# Altium project LM-003.PrjPcb (part 2 of 4)

## Sheet FeedbackLoop.SchDoc: Sync Demod
size Tabloid; DocumentNumber: LM-003; Revision: 3.0; SheetNumber: 2; SheetTotal: 11
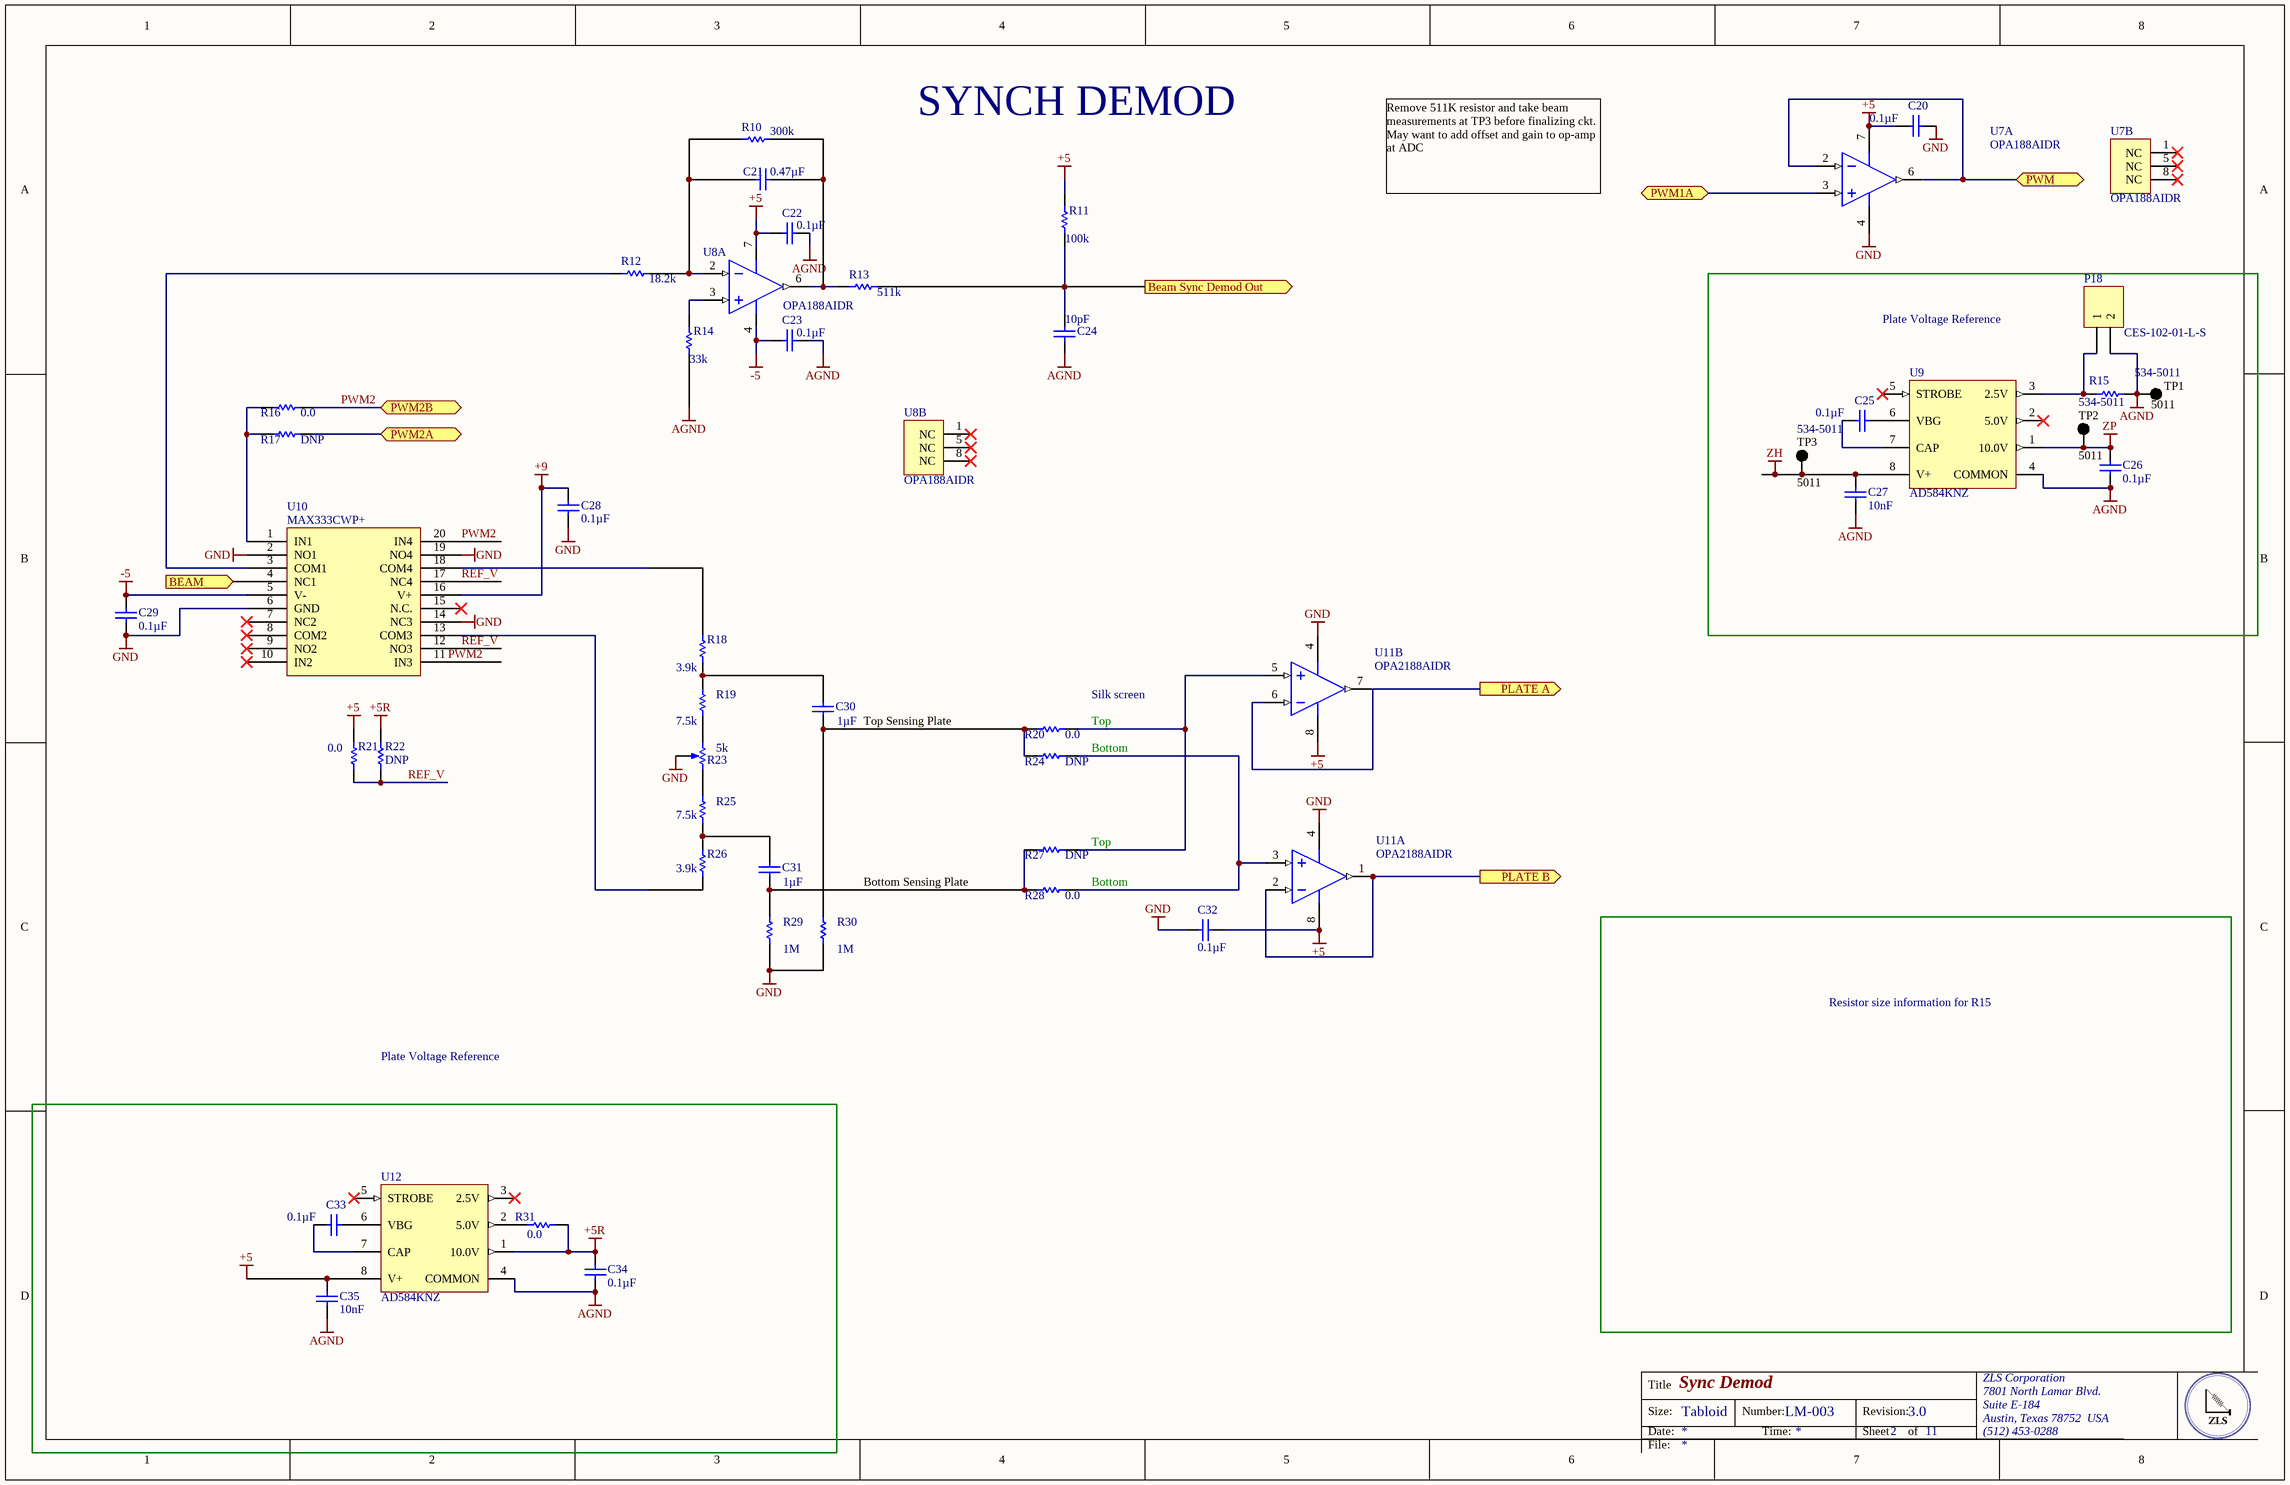
[diagram p1: FeedbackLoop.SchDoc]

### Parts
(Parts that share a designator on the sheet are numbered #1, #2 ... from top to bottom, then left to right.)
C20  Capacitance: 0.1µF  [CAPC0805(2012)100_N]  (hidden comment: CAP 100nF 25V 0805(2012))
C21  Capacitance: 0.47µF  [CAPC0805(2012)145_N]  (hidden comment: CAP CER 0.47UF 25V X7R 0805)
C22  Capacitance: 0.1µF  [CAPC0805(2012)145_N]  (hidden comment: CAP CER 0.1UF 16V X7R 0805)
C23  Capacitance: 0.1µF  [CAPC0805(2012)145_N]  (hidden comment: CAP CER 0.1UF 25V X7R 0805)
C24  Capacitance: 10pF  [CAPC0805(2012)145_N]  (hidden comment: CAP CER 10PF 200V C0G/NP0 0805)
C25  Capacitance: 0.1µF  [CAPC0805(2012)100_N]  (hidden comment: CAP 100nF 25V 0805(2012))
C26  Capacitance: 0.1µF  [CAPC0805(2012)145_N]  (hidden comment: CAP CER 0.1UF 25V X7R 0805)
C27  Capacitance: 10nF  [CAPC0805(2012)145_N]  (hidden comment: Multilayer Ceramic Capacitors MLCC - SMD/SMT 0.01uF 50volts 10% X7R)
C28  Capacitance: 0.1µF  [CAPC0805(2012)145_N]  (hidden comment: CAP CER 0.1UF 25V X7R 0805)
C29  Capacitance: 0.1µF  [CAPC0805(2012)145_N]  (hidden comment: CAP CER 0.1UF 25V X7R 0805)
C30  Capacitance: 1µF  [CAPC0805(2012)155_L]  (hidden comment: CAP CER 1UF 25V X7R 0805)
C31  Capacitance: 1µF  [CAPC0805(2012)155_L]  (hidden comment: CAP CER 1UF 25V X7R 0805)
C32  Capacitance: 0.1µF  [CAPC0805(2012)155_L]  (hidden comment: CAP CER 0.1UF 25V X7R 0805)
C33  Capacitance: 0.1µF  [CAPC0805(2012)100_N]  (hidden comment: CAP 100nF 25V 0805(2012))
C34  Capacitance: 0.1µF  [CAPC0805(2012)145_N]  (hidden comment: CAP CER 0.1UF 25V X7R 0805)
C35  Capacitance: 10nF  [CAPC0805(2012)145_N]  (hidden comment: Multilayer Ceramic Capacitors MLCC - SMD/SMT 0.01uF 50volts 10% X7R)
P18  LOW PROFILE .025" SQUARE STRIPS  [CES-102-01-L-S]  (value not drawn)
R10  Resistance (Ohms): 300k  [RESC0805(2012)_M]  (hidden comment: RES SMD 300K OHM 1% 1/8W 0805)
R11  Resistance (Ohms): 100k  [RESC0805(2012)_M]  (hidden comment: RES SMD 100K OHM 1% 1/2W 0805)
R12  Resistance (Ohms): 18.2k  [RESC0805(2012)_M]  (hidden comment: RES SMD 18.2K OHM 1% 1/8W 0805)
R13  Resistance (Ohms): 511k  [RESC0805(2012)_M]  (hidden comment: RES SMD 511K OHM 1% 1/8W 0805)
R14  Resistance (Ohms): 33k  [RESC0805(2012)_M]  (hidden comment: RES SMD 33K OHM 1% 1/2W 0805)
R15  TBD  [VH102K]  (value not drawn)
R16  Resistance (Ohms): 0.0  [RESC0805(2012)_M]  (hidden comment: RES SMD 0.0 OHM JUMPER 1/8W 0805)
R17  Resistance (Ohms): DNP  [RESC0805(2012)_M]  (hidden comment: RES SMD 0.0 OHM JUMPER 1/8W 0805)
R18  Resistance (Ohms): 3.9k  [RESC0805(2012)_N]  (hidden comment: RES SMD 3.9K OHM 5% 1/8W 0805)
R19  Resistance (Ohms): 7.5k  [RESC0805(2012)_N]  (hidden comment: RES SMD 7.5K OHM 1% 1/8W 0805)
R20  Resistance (Ohms): 0.0  [RESC0805(2012)_M]  (hidden comment: RES SMD 0.0 OHM JUMPER 1/8W 0805)
R21  Resistance (Ohms): 0.0  [RESC0805(2012)_M]  (hidden comment: RES SMD 0.0 OHM JUMPER 1/8W 0805)
R22  DNP  [RESC0805(2012)_M]
R23  Resistance (Ohms): 5k  [Trimmer 2.54]  (hidden comment: TRIMMER 5K OHM 0.25W PC PIN)
R24  Resistance (Ohms): DNP  [RESC0805(2012)_M]  (hidden comment: RES SMD 0.0 OHM JUMPER 1/8W 0805)
R25  Resistance (Ohms): 7.5k  [RESC0805(2012)_N]  (hidden comment: RES SMD 7.5K OHM 1% 1/8W 0805)
R26  Resistance (Ohms): 3.9k  [RESC0805(2012)_N]  (hidden comment: RES SMD 3.9K OHM 5% 1/8W 0805)
R27  Resistance (Ohms): DNP  [RESC0805(2012)_M]  (hidden comment: RES SMD 0.0 OHM JUMPER 1/8W 0805)
R28  Resistance (Ohms): 0.0  [RESC0805(2012)_M]  (hidden comment: RES SMD 0.0 OHM JUMPER 1/8W 0805)
R29  Resistance (Ohms): 1M  [RESC0805(2012)_N]  (hidden comment: RES SMD 1M OHM 1% 1/8W 0805)
R30  Resistance (Ohms): 1M  [RESC0805(2012)_N]  (hidden comment: RES SMD 1M OHM 1% 1/8W 0805)
R31  Resistance (Ohms): 0.0  [RESC0805(2012)_M]  (hidden comment: RES SMD 0.0 OHM JUMPER 1/8W 0805)
TP1  5011  Supplier Part Number 1: 534-5011  [KSTN-5011_V]
TP2  5011  Supplier Part Number 1: 534-5011  [KSTN-5011_V]
TP3  5011  Supplier Part Number 1: 534-5011  [KSTN-5011_V]
U7#1  OPA188AIDR  [D0008A_M]  (part B of 2)
U7#2  OPA188AIDR  [D0008A_M]  (part A of 2)
U8#1  OPA188AIDR  [D0008A_M]  (part A of 2)
U8#2  OPA188AIDR  [D0008A_M]  (part B of 2)
U9  AD584KNZ  [ADI-N-8]
U10  MAX333CWP+  [TSOP65P640X90-20N]
U11  OPA2188AIDR  [D0008A_L]  (parts A,B of 2)
U12  AD584KNZ  [ADI-N-8]

### Blocks framed on the sheet
Plate Voltage Reference: C25-C27 P18 R15 TP1-TP3 U9

### Ports
BEAM (in), Beam Sync Demod Out (out), PLATE A (out), PLATE B (out), PWM, PWM1A, PWM2A, PWM2B

### Nets
+5: C20.1 C22.1 C32.1 C35.1 R11.2 R21.2 U7#2.7(V+) U8#1.7(V+) U11.8(V+) U12.8(V+)
+5R: C34.1 R22.2 R31.1 U12.1(10.0V)
+9: C28.2 U10.16(V+)
-5: C23.2 C29.1 U8#1.4(V-) U10.5(V-)
AGND: C22.2 C23.1 C24.2 C26.2 C27.2 C34.2 C35.2 P18.2 R14.1 R15.2 TP1.1 U9.4(COMMON) U12.4(COMMON)
GND: C20.2 C28.1 C29.2 C32.2 R23.2(b) R29.1 R30.1 U7#2.4(V-) U10.2(NO1) U10.6(GND) U10.14(NC3) U10.19(NO4) U11.4(V-)
ZH: C27.1 TP3.1 U9.8(V+)
ZP: C26.1 TP2.1 U9.1(10.0V)
BEAM: U10.4(NC1) ; port BEAM
PWM2: R16.1 U10.20(IN4) ; port PWM2B
REF_V: R21.1 R22.1 U10.12(NO3) U10.17(NC4)
NetC21_1: C21.1 R10.2 R12.2 U8#1.2(IN-)
NetC21_2: C21.2 R10.1 R13.2 U8#1.6(OUT)
NetC24_1: C24.1 R11.1 R13.1 ; port Beam Sync Demod Out
NetC25_1: C25.1 U9.7(CAP)
NetC25_2: C25.2 U9.6(VBG)
NetC30_1: C30.1 R20.2 R24.2 R30.2
NetC30_2: C30.2 R18.1 R19.2
NetC31_1: C31.1 R27.2 R28.2 R29.2
NetC31_2: C31.2 R25.1 R26.2
NetC33_1: C33.1 U12.7(CAP)
NetC33_2: C33.2 U12.6(VBG)
NetP3_2: U11.1(OUT_A) U11.2(IN_A-) ; port PLATE B
NetP3_4: U11.6(IN_B-) ; port PLATE A
NetP3_12: U7#2.2(IN-) U7#2.6(OUT) ; port PWM
NetP18_1: P18.1 R15.1 U9.3(2.5V)
NetR12_1: R12.1 U10.3(COM1)
NetR14_2: R14.2 U8#1.3(IN+)
NetR16_2: R16.2 R17.2 U10.1(IN1)
NetR17_1: R17.1 ; port PWM2A
NetR18_2: R18.2 U10.18(COM4)
NetR19_1: R19.1 R23.3(c)
NetR20_1: R20.1 R27.1 U11.5(IN_B+)
NetR23_1: R23.1(a) R25.2
NetR24_1: R24.1 R28.1 U11.3(IN_A+)
NetR26_1: R26.1 U10.13(COM3)
NetR31_2: R31.2 U12.2(5.0V)
NetU7#2_3: U7#2.3(IN+) ; port PWM1A

Not connected (* = marked no-connect by the designer): U7#1 1(NC)* 5(NC)* 8(NC)*; U8#2 1(NC)* 5(NC)* 8(NC)*; U9 2(5.0V)* 5(STROBE)*; U10 7(NC2)* 8(COM2)* 9(NO2)* 10(IN2)* 11(IN3) 15(N.C.)*; U11 7(OUT_B); U12 3(2.5V)* 5(STROBE)*

### Notes on the sheet
- SYNCH DEMOD
- Remove 511K resistor and take beam measurements at TP3 before finalizing ckt.
  May want to add offset and gain to op-amp at ADC
- Silk screen
- (near C30) Top Sensing Plate
- Top
- Bottom
- Bottom Sensing Plate
- (near R27) Top
- Resistor size information for R15
- Plate Voltage Reference
- Labels drawn without touching a wire or pin: PWM2
- Title
- Size:
- Date:
- Tabloid
- Number:
- Time:
- Revision:
- Sheet
- of
- ZLS Corporation
- 7801 North Lamar Blvd.
- Suite E-184
- Austin, Texas 78752  USA
- (512) 453-0288
- File:

### Library data of the parts
C20 C25 C33 = CMP-1036-04416-1: CAP 100nF 25V -20% to +80% 0805 (2012 Metric) Thickness 1mm SMD; Manufacturer: Murata Electronics North America; Manufacturer Part Number: GRM21BR71E104KA01L; Tolerance: ±10%; Temperature Coefficient: X7R; Supplier 1: Digi-Key; Supplier Part Number 1: 490-1673-1-ND; RoHS: RoHS Compliant; Category: Capacitors; Stock 1: 895391; Pricing 1: 1=0.2, 10=0.145, 100=0.0683, 500=0.04788, 1000=0.03964 (USD); Packaging: Cut Tape (CT); Part Status: Active; Voltage - Rated: 25V; Operating Temperature: -55°C ~ 125°C; Features: -; Ratings: -; Applications: General Purpose; Mounting Type: Surface Mount, MLCC; Package / Case: 0805 (2012 Metric); Size / Dimension: 0.079" L x 0.049" W (2.00mm x 1.25mm); Height - Seated (Max): -; Thickness (Max): 0.053" (1.35mm); Lead Spacing: -; Lead Style: -; ComponentLink1URL: http://www.murata.com/~/media/webrenewal/support/library/catalog/products/capacitor/mlcc/c02e.ashx; ComponentLink1Description: http://www.murata.com/~/media/webrenewal/support/library/catalog/products/capacitor/mlcc/c02e.ashx
C21 = CMP-1036-04795-1: Manufacturer: Murata Electronics North America; Manufacturer Part Number: GRM219R71E474KA88D; Tolerance: ±10%; Supplier 1: Digi-Key; Supplier Part Number 1: 490-11584-6-ND; RoHS: RoHS Compliant; Category: Capacitors; Stock 1: 575; Pricing 1: 1=0.33, 10=0.229, 100=0.1377, 500=0.10324, 1000=0.08718 (USD); Packaging: Digi-Reel®; Part Status: Active; Voltage - Rated: 25V; Temperature Coefficient: X7R; Operating Temperature: -55°C ~ 125°C; Features: -; Ratings: -; Applications: General Purpose; Mounting Type: Surface Mount, MLCC; Package / Case: 0805 (2012 Metric); Size / Dimension: 0.079" L x 0.049" W (2.00mm x 1.25mm); Height - Seated (Max): -; Thickness (Max): 0.037" (0.95mm); Lead Spacing: -; Lead Style: -; ComponentLink1URL: http://www.murata.com/~/media/webrenewal/support/library/catalog/products/capacitor/mlcc/c02e.ashx; ComponentLink1Description: http://www.murata.com/~/media/webrenewal/support/library/catalog/products/capacitor/mlcc/c02e.ashx
C22 = CMP-1036-04795-1: Manufacturer: Murata Electronics North America; Manufacturer Part Number: GRM219R71C104KA01D; Tolerance: ±10%; Voltage - Rated: 25V; Supplier Part Number 1: 490-1673-6-ND; Temperature Coefficient: X7R; Thickness (Max): 0.053" (1.35mm); Supplier 2: Digi-Key; Supplier Part Number 2: 490-1683-6-ND; RoHS: RoHS Compliant; Category: Capacitors; Stock 2: 245331; Pricing 2: 1=0.14, 10=0.098, 100=0.0462, 500=0.0324, 1000=0.02683 (USD); Packaging: Digi-Reel®; Part Status: Active; Operating Temperature: -55°C ~ 125°C; Features: -; Ratings: -; Applications: General Purpose; Mounting Type: Surface Mount, MLCC; Package / Case: 0805 (2012 Metric); Size / Dimension: 0.079" L x 0.049" W (2.00mm x 1.25mm); Height - Seated (Max): -; Lead Spacing: -; Lead Style: -; ComponentLink1URL: http://www.murata.com/~/media/webrenewal/support/library/catalog/products/capacitor/mlcc/c02e.ashx; ComponentLink1Description: http://www.murata.com/~/media/webrenewal/support/library/catalog/products/capacitor/mlcc/c02e.ashx
C23 C26 C28 C29 C34 = CMP-1036-04795-1: Manufacturer: Murata Electronics North America; Manufacturer Part Number: GRM21BR71E104KA01L; Tolerance: ±10%; Supplier 1: Digi-Key; Supplier Part Number 1: 490-1673-6-ND; RoHS: RoHS Compliant; Category: Capacitors; Stock 1: 891652; Pricing 1: 1=0.2, 10=0.145, 100=0.0683, 500=0.04788, 1000=0.03964 (USD); Packaging: Digi-Reel®; Part Status: Active; Voltage - Rated: 25V; Temperature Coefficient: X7R; Operating Temperature: -55°C ~ 125°C; Features: -; Ratings: -; Applications: General Purpose; Mounting Type: Surface Mount, MLCC; Package / Case: 0805 (2012 Metric); Size / Dimension: 0.079" L x 0.049" W (2.00mm x 1.25mm); Height - Seated (Max): -; Thickness (Max): 0.053" (1.35mm); Lead Spacing: -; Lead Style: -; ComponentLink1URL: http://www.murata.com/~/media/webrenewal/support/library/catalog/products/capacitor/mlcc/c02e.ashx; ComponentLink1Description: http://www.murata.com/~/media/webrenewal/support/library/catalog/products/capacitor/mlcc/c02e.ashx
C24 = CMP-1036-04795-1: Manufacturer: Murata Electronics North America; Manufacturer Part Number: GRM21A5C2D100JW01D; Tolerance: ±5%; Temperature Coefficient: C0G, NP0; Supplier 1: Digi-Key; Supplier Part Number 1: 490-14649-1-ND; RoHS: RoHS Compliant; Category: Capacitors; Stock 1: 957; Pricing 1: 1=0.3, 10=0.205, 100=0.1038, 500=0.07104, 1000=0.06285 (USD); Packaging: Cut Tape (CT); Part Status: Active; Voltage - Rated: 200V; Operating Temperature: -55°C ~ 125°C; Features: -; Ratings: -; Applications: General Purpose; Failure Rate: -; Mounting Type: Surface Mount, MLCC; Package / Case: 0805 (2012 Metric); Size / Dimension: 0.079" L x 0.049" W (2.00mm x 1.25mm); Height - Seated (Max): -; Thickness (Max): 0.039" (1.00mm); Lead Spacing: -; Lead Style: -; ComponentLink1URL: http://search.murata.co.jp/Ceramy/image/img/A01X/G101/ENG/GRM21A5C2D100JW01-01.pdf; ComponentLink1Description: http://search.murata.co.jp/Ceramy/image/img/A01X/G101/ENG/GRM21A5C2D100JW01-01.pdf
C27 C35 = CMP-1036-04795-1: Manufacturer: Kemet; Manufacturer Part Number: C0805C103K5RACAUTO; Voltage Rating: 50V; Supplier 1: Digi-Key; Supplier Part Number 1: 399-6924-1-ND; Stock 1: 63236; Pricing 1: 1=0.12, 10=0.087, 100=0.041, 500=0.0287, 1000=0.0238 (USD); Mount: Surface Mount; Case/Package: 0805; Case Code (Metric): 2012; Case Code (Imperial): 0805; Dielectric Material: Ceramic; Contact Plating: Tin; Min Operating Temperature: -55°C; Max Operating Temperature: 125°C; Tolerance: 10%; Packaging: Tape and Reel; Package Quantity: 1; Voltage Rating (DC): 50V; Dielectric: X7R; Termination: SMD/SMT; Length: 2mm; Height: 0.78mm; Width: 0.049inch; Thickness: 0.035inch; Depth: 1.25mm; Radiation Hardening: No; REACH SVHC: No SVHC; ComponentLink1URL: https://datasheet.ciiva.com/22700/1693454-22700519.pdf; ComponentLink1Description: https://datasheet.ciiva.com/22700/1693454-22700519.pdf; ComponentLink2URL: https://datasheet.ciiva.com/7842/1693454-7842175.pdf; ComponentLink2Description: https://datasheet.ciiva.com/7842/1693454-7842175.pdf
C30 C31 = CMP-1036-04882-1: Manufacturer: Murata Electronics North America; Manufacturer Part Number: GRM21BR71E105KA99L; Tolerance: ±10%; Supplier 1: Digi-Key; Supplier Part Number 1: 490-6484-6-ND; RoHS: RoHS Compliant; Category: Capacitors; Stock 1: 295074; Pricing 1: 1=0.14, 10=0.099, 100=0.0468, 500=0.0328, 1000=0.02715 (USD); Packaging: Digi-Reel®; Part Status: Active; Voltage - Rated: 25V; Temperature Coefficient: X7R; Operating Temperature: -55°C ~ 125°C; Features: -; Ratings: -; Applications: General Purpose; Mounting Type: Surface Mount, MLCC; Package / Case: 0805 (2012 Metric); Size / Dimension: 0.079" L x 0.049" W (2.00mm x 1.25mm); Height - Seated (Max): -; Thickness (Max): 0.053" (1.35mm); Lead Spacing: -; Lead Style: -; ComponentLink1URL: http://www.murata.com/~/media/webrenewal/support/library/catalog/products/capacitor/mlcc/c02e.ashx; ComponentLink1Description: http://www.murata.com/~/media/webrenewal/support/library/catalog/products/capacitor/mlcc/c02e.ashx
C32 = CMP-1036-04882-1: Manufacturer: Murata Electronics North America; Manufacturer Part Number: GRM21BR71E104KA01L; Tolerance: ±10%; Supplier 1: Digi-Key; Supplier Part Number 1: 490-1673-6-ND; RoHS: RoHS Compliant; Category: Capacitors; Stock 1: 891652; Pricing 1: 1=0.2, 10=0.145, 100=0.0683, 500=0.04788, 1000=0.03964 (USD); Packaging: Digi-Reel®; Part Status: Active; Voltage - Rated: 25V; Temperature Coefficient: X7R; Operating Temperature: -55°C ~ 125°C; Features: -; Ratings: -; Applications: General Purpose; Mounting Type: Surface Mount, MLCC; Package / Case: 0805 (2012 Metric); Size / Dimension: 0.079" L x 0.049" W (2.00mm x 1.25mm); Height - Seated (Max): -; Thickness (Max): 0.053" (1.35mm); Lead Spacing: -; Lead Style: -; ComponentLink1URL: http://www.murata.com/~/media/webrenewal/support/library/catalog/products/capacitor/mlcc/c02e.ashx; ComponentLink1Description: http://www.murata.com/~/media/webrenewal/support/library/catalog/products/capacitor/mlcc/c02e.ashx
P18 = Header 2: Manufacturer: Samtec Inc.; Connector Type: Receptacle; Style: Board to Board; Number of Positions: 2; Number of Positions Loaded: All; Pitch - Mating: 0.100" (2.54mm); Contact Length - Post: 0.128" (3.25mm); Material Flammability Rating: UL94 V-0; Supplier 1: Digi-Key; Supplier Part Number 1: CES-102-01-L-S-ND; Manufacturer Part Number: CES-102-01-L-S; RoHS: RoHS Compliant; Category: Connectors, Interconnects; Stock 1: 0; Pricing 1: 1=0.61 (USD); Packaging: Bulk; Part Status: Active; Contact Type: Female Socket; Number of Rows: 1; Row Spacing - Mating: -; Mounting Type: Through Hole; Termination: Solder; Fastening Type: Push-Pull; Contact Finish - Mating: Gold; Contact Finish Thickness - Mating: 10µin (0.25µm); Insulation Color: Black; Insulation Height: 0.200" (5.08mm); Operating Temperature: -55°C ~ 125°C; Contact Finish - Post: Tin; Mated Stacking Heights: -; Ingress Protection: -; Features: -; Current Rating: -; Voltage Rating: -; Applications: -; Insulation Material: Polybutylene Terephthalate (PBT); Contact Shape: Square; Contact Material: Phosphor Bronze; Contact Finish Thickness - Post: -; ComponentLink1URL: http://suddendocs.samtec.com/prints/ces-1xx-xx-x-s-xx-mkt.pdf; ComponentLink1Description: http://suddendocs.samtec.com/prints/ces-1xx-xx-x-s-xx-mkt.pdf
R10 = CMP-1013-00017-1: Manufacturer: Vishay Dale; Manufacturer Part Number: CRCW0805300KFKEA; Power (Watts): 0.125W, 1/8W; Temperature Coefficient: ±100ppm/°C; Supplier 1: Digi-Key; Supplier Part Number 1: 541-300KCDKR-ND; RoHS: RoHS Compliant; Category: Resistors; Stock 1: 22918; Pricing 1: 1=0.1, 10=0.044, 100=0.0178, 1000=0.00802, 2500=0.00696 (USD); Packaging: Digi-Reel®; Part Status: Active; Tolerance: ±1%; Composition: Thick Film; Features: Automotive AEC-Q200; Operating Temperature: -55°C ~ 155°C; Package / Case: 0805 (2012 Metric); Supplier Device Package: 0805; Size / Dimension: 0.079" L x 0.049" W (2.00mm x 1.25mm); Height - Seated (Max): 0.020" (0.50mm); Failure Rate: -; ComponentLink1URL: http://www.vishay.com/docs/20035/dcrcwe3.pdf; ComponentLink1Description: http://www.vishay.com/docs/20035/dcrcwe3.pdf
R11 = CMP-1013-00017-1: Manufacturer: Vishay Dale; Manufacturer Part Number: CRCW0805100KFKEAHP; Power (Watts): 0.5W, 1/2W; Temperature Coefficient: ±100ppm/°C; Supplier 1: Digi-Key; Supplier Part Number 1: 541-100KTDKR-ND; RoHS: RoHS Compliant; Category: Resistors; Stock 1: 1548; Pricing 1: 1=0.28, 10=0.233, 100=0.0911, 1000=0.03812, 2500=0.03494 (USD); Packaging: Digi-Reel®; Part Status: Active; Tolerance: ±1%; Composition: Thick Film; Features: Automotive AEC-Q200, Pulse Withstanding; Operating Temperature: -55°C ~ 155°C; Package / Case: 0805 (2012 Metric); Supplier Device Package: 0805; Size / Dimension: 0.079" L x 0.049" W (2.00mm x 1.25mm); Height - Seated (Max): 0.020" (0.50mm); Failure Rate: -; ComponentLink1URL: http://www.vishay.com/docs/20043/crcwhpe3.pdf; ComponentLink1Description: http://www.vishay.com/docs/20043/crcwhpe3.pdf
R12 = CMP-1013-00017-1: Manufacturer: Vishay Dale; Manufacturer Part Number: CRCW080518K2FKEA; Power (Watts): 0.125W, 1/8W; Temperature Coefficient: ±100ppm/°C; Supplier 1: Digi-Key; Supplier Part Number 1: 541-18.2KCDKR-ND; RoHS: RoHS Compliant; Category: Resistors; Stock 1: 12440; Pricing 1: 1=0.1, 10=0.044, 100=0.0178, 1000=0.00802, 2500=0.00696 (USD); Packaging: Digi-Reel®; Part Status: Active; Tolerance: ±1%; Composition: Thick Film; Features: Automotive AEC-Q200; Operating Temperature: -55°C ~ 155°C; Package / Case: 0805 (2012 Metric); Supplier Device Package: 0805; Size / Dimension: 0.079" L x 0.049" W (2.00mm x 1.25mm); Height - Seated (Max): 0.020" (0.50mm); Failure Rate: -; ComponentLink1URL: http://www.vishay.com/docs/20035/dcrcwe3.pdf; ComponentLink1Description: http://www.vishay.com/docs/20035/dcrcwe3.pdf
R13 = CMP-1013-00017-1: Manufacturer: Vishay Dale; Manufacturer Part Number: CRCW0805511KFKEA; Power (Watts): 0.125W, 1/8W; Temperature Coefficient: ±100ppm/°C; Supplier 1: Digi-Key; Supplier Part Number 1: 541-511KCDKR-ND; RoHS: RoHS Compliant; Category: Resistors; Stock 1: 39; Pricing 1: 1=0.1, 10=0.044, 100=0.0178, 1000=0.00802, 2500=0.00696 (USD); Packaging: Digi-Reel®; Part Status: Active; Tolerance: ±1%; Composition: Thick Film; Features: Automotive AEC-Q200; Operating Temperature: -55°C ~ 155°C; Package / Case: 0805 (2012 Metric); Supplier Device Package: 0805; Size / Dimension: 0.079" L x 0.049" W (2.00mm x 1.25mm); Height - Seated (Max): 0.020" (0.50mm); Failure Rate: -; ComponentLink1URL: http://www.vishay.com/docs/20035/dcrcwe3.pdf; ComponentLink1Description: http://www.vishay.com/docs/20035/dcrcwe3.pdf
R14 = CMP-1013-00017-1: Manufacturer: Vishay Dale; Manufacturer Part Number: CRCW080533K0FKEAHP; Power (Watts): 0.5W, 1/2W; Temperature Coefficient: ±100ppm/°C; Supplier 1: Digi-Key; Supplier Part Number 1: 541-33.0KTDKR-ND; RoHS: RoHS Compliant; Category: Resistors; Stock 1: 4835; Pricing 1: 1=0.28, 10=0.233, 100=0.0911, 1000=0.03812, 2500=0.03494 (USD); Packaging: Digi-Reel®; Part Status: Active; Tolerance: ±1%; Composition: Thick Film; Features: Automotive AEC-Q200, Pulse Withstanding; Operating Temperature: -55°C ~ 155°C; Package / Case: 0805 (2012 Metric); Supplier Device Package: 0805; Size / Dimension: 0.079" L x 0.049" W (2.00mm x 1.25mm); Height - Seated (Max): 0.020" (0.50mm); Failure Rate: -; ComponentLink1URL: http://www.vishay.com/docs/20043/crcwhpe3.pdf; ComponentLink1Description: http://www.vishay.com/docs/20043/crcwhpe3.pdf
R15 = CMP-1013-00393-1
R16 R17 R20 R21 R24 R27 R28 R31 = CMP-1013-00017-1: Manufacturer: Vishay Dale; Manufacturer Part Number: CRCW08050000Z0EA; Power (Watts): 0.125W, 1/8W; Supplier 1: Digi-Key; Supplier Part Number 1: 541-0.0ADKR-ND; RoHS: RoHS Compliant; Category: Resistors; Stock 1: 407603; Pricing 1: 1=0.1, 10=0.026, 25=0.0184, 50=0.014, 100=0.0104, 250=0.00792, 500=0.00634, 1000=0.00466 (USD); Packaging: Digi-Reel®; Part Status: Active; Tolerance: Jumper; Composition: Thick Film; Features: Automotive AEC-Q200; Temperature Coefficient: -; Operating Temperature: -55°C ~ 155°C; Package / Case: 0805 (2012 Metric); Supplier Device Package: 0805; Size / Dimension: 0.079" L x 0.049" W (2.00mm x 1.25mm); Height - Seated (Max): 0.020" (0.50mm); Failure Rate: -; ComponentLink1URL: http://www.vishay.com/docs/20035/dcrcwe3.pdf; ComponentLink1Description: http://www.vishay.com/docs/20035/dcrcwe3.pdf
R18 R26 = CMP-1013-00606-1: Manufacturer: Vishay Dale; Manufacturer Part Number: CRCW08053K90JNEA; Power (Watts): 0.125W, 1/8W; Temperature Coefficient: ±200ppm/°C; Supplier 1: Digi-Key; Supplier Part Number 1: 541-3.9KADKR-ND; RoHS: RoHS Compliant; Category: Resistors; Stock 1: 20963; Pricing 1: 1=0.1, 10=0.028, 100=0.0114, 1000=0.00513, 2500=0.00445 (USD); Packaging: Digi-Reel®; Part Status: Active; Tolerance: ±5%; Composition: Thick Film; Features: Automotive AEC-Q200; Operating Temperature: -55°C ~ 155°C; Package / Case: 0805 (2012 Metric); Supplier Device Package: 0805; Size / Dimension: 0.079" L x 0.049" W (2.00mm x 1.25mm); Height - Seated (Max): 0.020" (0.50mm); Failure Rate: -; ComponentLink1URL: http://www.vishay.com/docs/20035/dcrcwe3.pdf; ComponentLink1Description: http://www.vishay.com/docs/20035/dcrcwe3.pdf
R19 R25 = CMP-1013-00606-1: Manufacturer: Vishay Dale; Manufacturer Part Number: CRCW08057K50FKEA; Power (Watts): 0.125W, 1/8W; Temperature Coefficient: ±100ppm/°C; Supplier 1: Digi-Key; Supplier Part Number 1: 541-7.50KCDKR-ND; RoHS: RoHS Compliant; Category: Resistors; Stock 1: 0; Pricing 1: 1=0.1, 10=0.044, 100=0.0178, 1000=0.00802, 2500=0.00696 (USD); Packaging: Digi-Reel®; Part Status: Active; Tolerance: ±1%; Composition: Thick Film; Features: Automotive AEC-Q200; Operating Temperature: -55°C ~ 155°C; Package / Case: 0805 (2012 Metric); Supplier Device Package: 0805; Size / Dimension: 0.079" L x 0.049" W (2.00mm x 1.25mm); Height - Seated (Max): 0.020" (0.50mm); Failure Rate: -; ComponentLink1URL: http://www.vishay.com/docs/20035/dcrcwe3.pdf; ComponentLink1Description: http://www.vishay.com/docs/20035/dcrcwe3.pdf
R22 = CMP-1013-00017-1: RES SMD 0.0 OHM JUMPER 1/8W 0805; Manufacturer: Vishay Dale; Manufacturer Part Number: CRCW08050000Z0EA; Resistance (Ohms): 0.0; Power (Watts): 0.125W, 1/8W; Supplier 1: Digi-Key; Supplier Part Number 1: 541-0.0ADKR-ND; RoHS: RoHS Compliant; Category: Resistors; Stock 1: 407603; Pricing 1: 1=0.1, 10=0.026, 25=0.0184, 50=0.014, 100=0.0104, 250=0.00792, 500=0.00634, 1000=0.00466 (USD); Packaging: Digi-Reel®; Part Status: Active; Tolerance: Jumper; Composition: Thick Film; Features: Automotive AEC-Q200; Temperature Coefficient: -; Operating Temperature: -55°C ~ 155°C; Package / Case: 0805 (2012 Metric); Supplier Device Package: 0805; Size / Dimension: 0.079" L x 0.049" W (2.00mm x 1.25mm); Height - Seated (Max): 0.020" (0.50mm); Failure Rate: -; ComponentLink1URL: http://www.vishay.com/docs/20035/dcrcwe3.pdf; ComponentLink1Description: http://www.vishay.com/docs/20035/dcrcwe3.pdf
R23 = Trimmer: Manufacturer: Vishay Foil Resistors (Division of Vishay Precision Group); Manufacturer Part Number: Y00535K00000J0L; Power (Watts): 0.25W, 1/4W; Tolerance: ±5%; Temperature Coefficient: ±10ppm/°C; Number of Turns: 21; Adjustment Type: Side Adjustment; Resistive Material: Metal Foil; Supplier 1: Digi-Key; Supplier Part Number 1: 804-1020-ND; RoHS: RoHS Compliant; Category: Potentiometers, Variable Resistors; Stock 1: 679; Pricing 1: 1=34.42, 10=32.265, 25=26.5292, 50=22.944, 100=22.227, 250=20.793, 500=19.2156 (USD); Packaging: Bulk; Part Status: Active; Mounting Type: Through Hole; Termination Style: PC Pins; Size / Dimension: Rectangular - 0.250" x 0.175" Face x 0.250" L (6.35mm x 4.45mm x 6.35mm); ComponentLink1URL: http://www.vishaypg.com/docs/63053/1240.pdf; ComponentLink1Description: http://www.vishaypg.com/docs/63053/1240.pdf
R29 R30 = CMP-1013-00606-1: Manufacturer: Vishay Dale; Manufacturer Part Number: CRCW08051M00FKEA; Power (Watts): 0.125W, 1/8W; Temperature Coefficient: ±100ppm/°C; Supplier 1: Digi-Key; Supplier Part Number 1: 541-1.00MCDKR-ND; RoHS: RoHS Compliant; Category: Resistors; Stock 1: 44065; Pricing 1: 1=0.1, 10=0.044, 100=0.0178, 1000=0.00802, 2500=0.00696 (USD); Packaging: Digi-Reel®; Part Status: Active; Tolerance: ±1%; Composition: Thick Film; Features: Automotive AEC-Q200; Operating Temperature: -55°C ~ 155°C; Package / Case: 0805 (2012 Metric); Supplier Device Package: 0805; Size / Dimension: 0.079" L x 0.049" W (2.00mm x 1.25mm); Height - Seated (Max): 0.020" (0.50mm); Failure Rate: -; ComponentLink1URL: http://www.vishay.com/docs/20035/dcrcwe3.pdf; ComponentLink1Description: http://www.vishay.com/docs/20035/dcrcwe3.pdf
TP1-TP3 = CMP-1672-00003-4: Test Point, Black, Through Hole, RoHS, Bulk; Manufacturer: Keystone; Body Material: PBT; Gender: Female; Number of Ports: 1; Inside Diameter: 1.78mm; Hole Diameter: 1.6mm; ComponentLink2URL: http://www.keyelco.com/product-pdf.cfm?p=1320; Colour: Black; Pins: 1; REACH SVHC: No SVHC; ComponentLink1URL: http://www.keyelco.com/; PackageReference: 5011; Contact Plating: Silver; Package Quantity: 100; Packaging: Bulk; RoHSCompliant: true; Height: 8.12 mm; PackageDescription: 1-Pin Through Hole Device, Dia 3.17 mm; Mount: Through Hole; Mounting Technology: Through Hole; DatasheetVersion: Rev. F, 12/2013; ComponentLink1Description: Manufacturer URL; Contact Material: Bronze; ComponentLink2Description: Datasheet; Supplier 1: Mouser; Manufacturer Part Number: 5011; Stock 1: 63090; Pricing 1: 1=0.53, 10=0.53, 50=0.53, 100=0.371, 1000=0.165, 10000=0.106 (USD); Case/Package: 125; Housing Colour: Black; Material: Bronze,Silver,Nylon; Orientation: Straight; Length: 11.3mm; Lead Free: Lead Free; ComponentLink3URL: https://datasheet.ciiva.com/1454/1718230-1454834.pdf; ComponentLink3Description: https://datasheet.ciiva.com/1454/1718230-1454834.pdf; ComponentLink4URL: https://datasheet.ciiva.com/2917/5011-2917635.pdf; ComponentLink4Description: https://datasheet.ciiva.com/2917/5011-2917635.pdf; ComponentLink5URL: https://datasheet.ciiva.com/16351/m60-2p60-16351093.pdf; ComponentLink5Description: https://datasheet.ciiva.com/16351/m60-2p60-16351093.pdf; ComponentLink6URL: https://datasheet.ciiva.com/11744/0900766b8009b7c7-11744935.pdf; ComponentLink6Description: https://datasheet.ciiva.com/11744/0900766b8009b7c7-11744935.pdf; ComponentLink7URL: https://datasheet.ciiva.com/46412/1703983-46412138.pdf; ComponentLink7Description: https://datasheet.ciiva.com/46412/1703983-46412138.pdf
U7#1 U7#2 U8#1 U8#2 = CMP-0809-00004-2: Precision, Low Noise, Rail-to-Rail Output, Zero-Drift Operational Amplifier, 4 to 36 V, -40 to 125 degC, 8-pin SOIC (D8), Green (RoHS & no Sb/Br); Manufacturer: Texas Instruments; Iq per channel(Max)(mA): 0.51; SubFamily: Zero Drift Precision Amplifier; Total Supply Voltage(Max)(+5V is 5, +/-5V is 10): 36; CMRR(Min)(dB): 120; Total Supply Voltage(Min)(+5V is 5, +/-5V is 10): 4; Slew Rate(Typ)(V/us): 0.8; GBW(Typ)(MHz): 2; Offset Drift(Typ)(uV/C): 0.03; Number of Channels: 1; Rating: Catalog; Packing: LARGE T&R; ComponentLink2URL: http://www.ti.com/lit/ds/symlink/opa188.pdf; Eco-Plan: Green (RoHS & no Sb/Br); DatasheetVersion: SBOS642A; PartNumber: OPA188AIDR; ComponentLink3Description: Package Specification; PackageDescription: 8-Pin Plastic Small Outline, Body 4.9 x 3.9 mm, Pitch 1.27 mm; Code_JEDEC: MS-012; ComponentLink1Description: Manufacturer URL; PackageReference: D0008A; Mounting Technology: Surface Mount; PackageVersion: 4040047-3/M, 06/2011; ComponentLink3URL: http://www.ti.com/litv/pdf/msoi002j; ComponentLink2Description: Datasheet; ComponentLink1URL: http://www.ti.com/; PartId: 1
U9 U12 = CMP-0784-00054-1: Pin Programmable, Precision Voltage Reference, + 2.5 / + 5 / + 7.5 / + 10 Prog V Output, 4.5 to 30 V Supply, Commercial, 8-pin DIP (N-8), Tube; Manufacturer: Analog Devices; Max V Supply (V): 30; Min V Supply (V): 4.5; Ref Out TC (ppm/C): 15; Vout: 2.5V, 5V, 7.5V, 10V; ComponentLink3URL: http:/www.analog.com/static/imported-files/packages/PKG_PDF/PDIP(N)/N_8.pdf; ComponentLink1URL: http://www.analog.com/en/index.html; PartNumber: AD584KNZ; ComponentLink1Description: Manufacturer URL; ComponentLink2Description: Datasheet; PackageDescription: 8-Pin Plastic Dual In-Line Package, Row spacing 7.62 mm, Pitch 2.54 mm; Operating Temp Range: 0 to 70 degC; DatasheetVersion: Rev. C; Code_JEDEC: MS-001; Packing: Tube; ComponentLink3Description: Package Specification; PackageReference: N-8; ComponentLink4Description: URL Link1; Mounting Technology: Through Hole; PackageVersion: 070606-A, 07/2006; ComponentLink4URL: Product URL:http://www.analog.com/en/special-linear-functions/voltage-references/ad584/products/product.html; ComponentLink2URL: http://www.analog.com/static/imported-files/data_sheets/AD584.pdf
U10 = MAX333CWP+: IC SWITCH QUAD SPDT 20TSSOP; Manufacturer: Maxim; Manufacturer Part Number: MAX333AEUP+; Max Supply Voltage: 30V; Min Supply Voltage: 10V; Min Dual Supply Voltage: 4.5V; Max Dual Supply Voltage: 20V; On-State Resistance: 35R; Operating Supply Current: 1uA; Supply Type: Single,Dual; Max Power Dissipation: 559mW; Turn-On Delay Time: 175ns; Turn-Off Delay Time: 145ns; Max Supply Current: 250uA; Number of Bits: 4; Dual Supply Voltage: 15V; Supplier 1: Mouser; Supplier Part Number 1: 700-MAX333AEUP; Stock 1: 664; Pricing 1: 1=6.77, 10=6.43, 50=5.8, 100=5.8, 1000=5.62, 10000=5.62 (USD); Case/Package: TSSOP; Number of Pins: 20; Weight: 0.006737oz; Min Operating Temperature: -40°C; Max Operating Temperature: 85°C; Packaging: Rail/Tube; Package Quantity: 74; Throw Configuration: SPDT; Number of Channels: 4; Length: 6.6mm; Height: 0.95mm; Width: 4.5mm; Radiation Hardening: No; Lead Free: Lead Free; REACH SVHC: Unknown; ComponentLink1URL: https://datasheet.ciiva.com/2978/max333a-2978850.pdf; ComponentLink1Description: https://datasheet.ciiva.com/2978/max333a-2978850.pdf; ComponentLink2URL: https://datasheet.ciiva.com/30478/0900766b81253c85-30478260.pdf; ComponentLink2Description: https://datasheet.ciiva.com/30478/0900766b81253c85-30478260.pdf; ComponentLink3URL: https://datasheet.ciiva.com/1674/max333a-1674617.pdf; ComponentLink3Description: https://datasheet.ciiva.com/1674/max333a-1674617.pdf; ComponentLink4URL: https://datasheet.ciiva.com/26825/max333aeup-26825546.pdf; ComponentLink4Description: https://datasheet.ciiva.com/26825/max333aeup-26825546.pdf
U11 = CMP-0272-00241-3: 0.03 uV/degC, 6 uV Vos, Low Noise, Rail-to-Rail Output, Zero-Drift Operational Amplifier, 4 to 36 V, -40 to 105 degC, 8-pin SOIC (D8), Green (RoHS & no Sb/Br); Manufacturer: Texas Instruments; Number of Circuits: 2; Slew Rate: 0.8 V/µs; Current - Supply: 415µA; Current - Output / Channel: 18mA; Voltage - Supply, Single/Dual (±): 4 V ~ 36 V, ±2 V ~ 18 V; Supplier 1: Digi-Key; Supplier Part Number 1: 296-29454-6-ND; Manufacturer Part Number: OPA2188AIDR; RoHS: RoHS Compliant; Category: Integrated Circuits (ICs); Stock 1: 8272; Pricing 1: 1=3.44, 10=3.089, 100=2.5307, 500=2.15434, 1000=1.81692 (USD); Packaging: Digi-Reel®; Part Status: Active; Amplifier Type: Zero-Drift; Output Type: Rail-to-Rail; -3db Bandwidth: -; Operating Temperature: -40°C ~ 105°C; Mounting Type: Surface Mount; Package / Case: 8-SOIC (0.154", 3.90mm Width); Supplier Device Package: 8-SOIC; ComponentLink1URL: http://www.ti.com/lit/ds/symlink/opa2188.pdf; ComponentLink1Description: http://www.ti.com/lit/ds/symlink/opa2188.pdf

## Sheet ADC.SchDoc: ADC
size OrCAD A; DocumentNumber: LM-003; Revision: 3.0; SheetNumber: 3; SheetTotal: 11
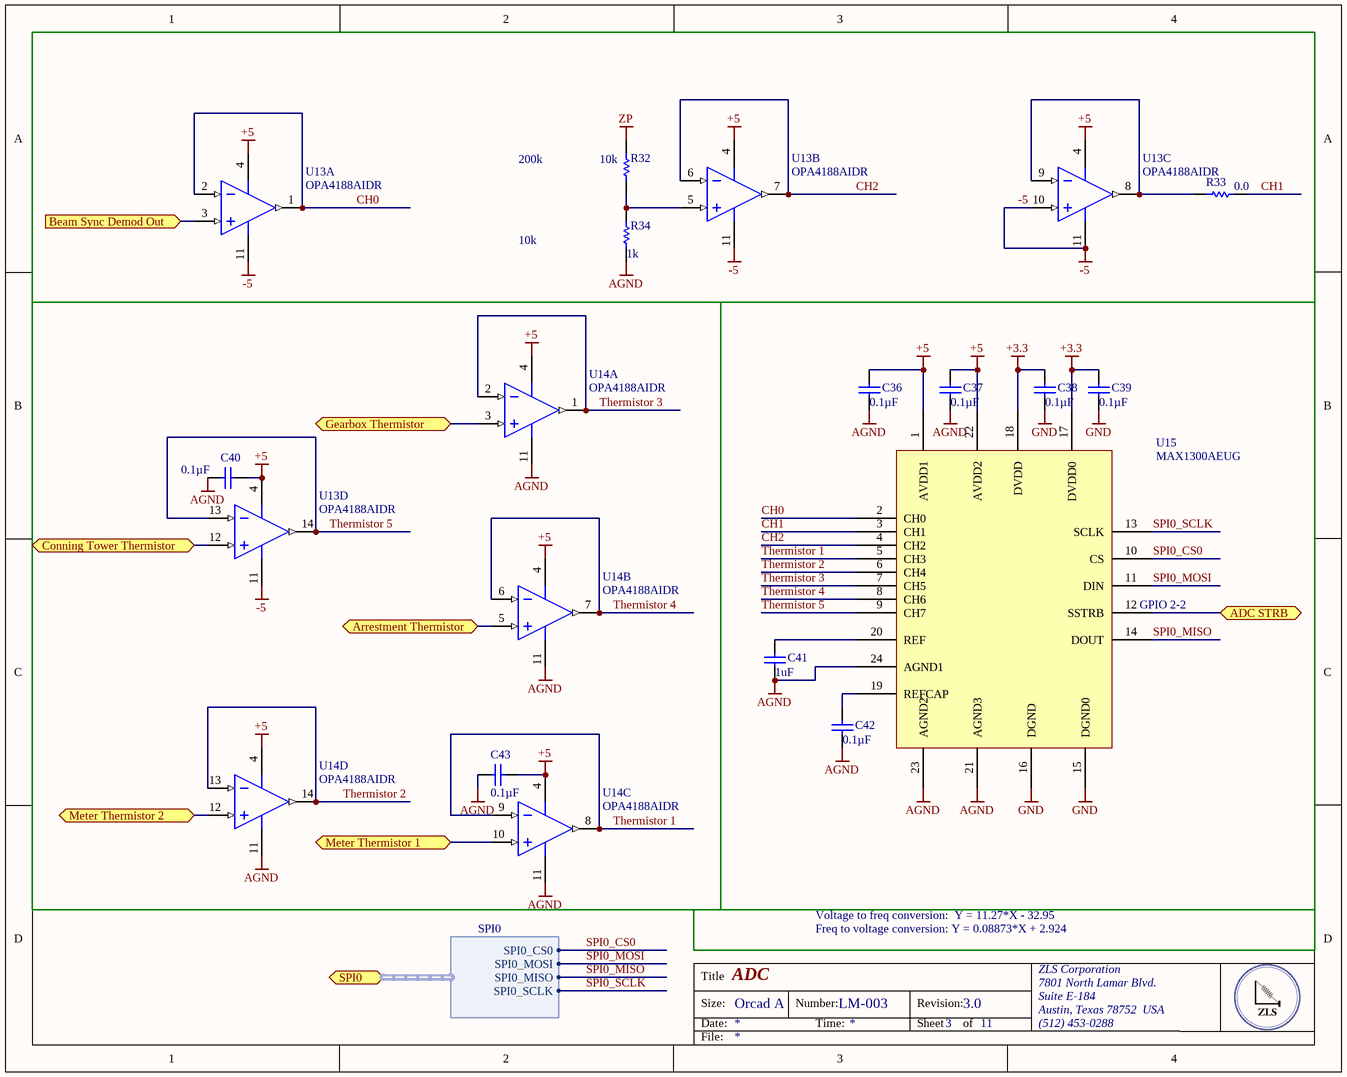
[diagram p2: ADC.SchDoc]

### Parts
C36  Capacitance: 0.1µF  [CAPC0805(2012)145_N]  (hidden comment: CAP CER 0.1UF 25V X7R 0805)
C37  Capacitance: 0.1µF  [CAPC0805(2012)145_N]  (hidden comment: CAP CER 0.1UF 25V X7R 0805)
C38  Capacitance: 0.1µF  [CAPC0805(2012)145_N]  (hidden comment: CAP CER 0.1UF 25V X7R 0805)
C39  Capacitance: 0.1µF  [CAPC0805(2012)145_N]  (hidden comment: CAP CER 0.1UF 25V X7R 0805)
C40  Capacitance: 0.1µF  [CAPC0805(2012)145_N]  (hidden comment: CAP CER 0.1UF 16V X7R 0805)
C41  Capacitance: 1uF  [CAPC0805(2012)145_N]  (hidden comment: CAP CER 1UF 16V X7R 0805)
C42  Capacitance: 0.1µF  [CAPC0805(2012)145_N]  (hidden comment: CAP CER 0.1UF 16V X7R 0805)
C43  Capacitance: 0.1µF  [CAPC0805(2012)145_N]  (hidden comment: CAP CER 0.1UF 16V X7R 0805)
R32  Resistance (Ohms): 10k  [RESC0805(2012)_M]  (hidden comment: RES SMD 10K OHM 1% 1/8W 0805)
R33  Resistance (Ohms): 0.0  [RESC0805(2012)_M]  (hidden comment: RES SMD 0.0 OHM JUMPER 1/8W 0805)
R34  Resistance (Ohms): 1k  [RESC0805(2012)_M]  (hidden comment: RES SMD 1K OHM 1% 1/8W 0805)
U13  OPA4188AIDR  [D0014A_L]  (parts A,B,C,D of 4)
U14  OPA4188AIDR  [D0014A_L]  (parts A,B,C,D of 4)
U15  MAX1300AEUG  [TSOP65P640X90-24N]

### Blocks framed on the sheet
GPIO 2-2: C36-C39 C41 C42 U15

### Ports
ADC STRB, Arrestment Thermistor, Beam Sync Demod Out (in), Conning Tower Thermistor, Gearbox Thermistor, Meter Thermistor 1, Meter Thermistor 2, SPI0 (harness SPI0)

### Harnesses
SPI0: SPI0_CS0, SPI0_MOSI, SPI0_MISO, SPI0_SCLK

### Nets
+3.3: C38.1 C39.1 U15.17(DVDD0) U15.18(DVDD)
+5: C36.1 C37.1 C40.2 C43.2 U13.4(V+) U14.4(V+) U15.1(AVDD1) U15.22(AVDD2)
-5: U13.10(IN_C+) U13.11(V-)
AGND: C36.2 C37.2 C40.1 C41.2 C42.2 C43.1 R34.1 U14.11(V-) U15.21(AGND3) U15.23(AGND2) U15.24(AGND1)
GND: C38.2 C39.2 U15.15(DGND0) U15.16(DGND)
ZP: R32.2
CH0: U13.1(OUT_A) U13.2(IN_A-) U15.2(CH0)
CH1: R33.1 U15.3(CH1)
CH2: U13.6(IN_B-) U13.7(OUT_B) U15.4(CH2)
SPI0_CS0: U15.10(CS) ; port SPI0.SPI0_CS0
SPI0_MISO: U15.14(DOUT) ; port SPI0.SPI0_MISO
SPI0_MOSI: U15.11(DIN) ; port SPI0.SPI0_MOSI
SPI0_SCLK: U15.13(SCLK) ; port SPI0.SPI0_SCLK
Thermistor 1: U14.8(OUT_C) U14.9(IN_C-) U15.5(CH3)
Thermistor 2: U14.13(IN_D-) U14.14(OUT_D) U15.6(CH4)
Thermistor 3: U14.1(OUT_A) U14.2(IN_A-) U15.7(CH5)
Thermistor 4: U14.6(IN_B-) U14.7(OUT_B) U15.8(CH6)
Thermistor 5: U13.13(IN_D-) U13.14(OUT_D) U15.9(CH7)
NetC24_1: U13.3(IN_A+) ; port Beam Sync Demod Out
NetC41_1: C41.1 U15.20(REF)
NetC42_1: C42.1 U15.19(REFCAP)
NetP7_2: U14.10(IN_C+) ; port Meter Thermistor 1
NetP7_4: U14.12(IN_D+) ; port Meter Thermistor 2
NetP8_4: U13.12(IN_D+) ; port Conning Tower Thermistor
NetP9_4: U14.5(IN_B+) ; port Arrestment Thermistor
NetP10_4: U14.3(IN_A+) ; port Gearbox Thermistor
NetR32_1: R32.1 R34.2 U13.5(IN_B+)
NetR33_2: R33.2 U13.8(OUT_C) U13.9(IN_C-)
NetU15_12: U15.12(SSTRB) ; port ADC STRB

### Notes on the sheet
- 200k
- 10k
- Freq to voltage conversion: Y = 0.08873*X + 2.924
- Voltage to freq conversion:  Y = 11.27*X - 32.95
- Title
- Size:
- Date:
- Orcad A
- Number:
- Time:
- Revision:
- Sheet
- of
- ZLS Corporation
- 7801 North Lamar Blvd.
- Suite E-184
- Austin, Texas 78752  USA
- (512) 453-0288
- File:

### Library data of the parts
C36-C39 = CMP-1036-04795-1: as C23 on sheet FeedbackLoop; Supplier 1: Digi-Key; Supplier Part Number 1: 490-1673-6-ND; RoHS: RoHS Compliant; Category: Capacitors; Stock 1: 891652; Pricing 1: 1=0.2, 10=0.145, 100=0.0683, 500=0.04788, 1000=0.03964 (USD); Packaging: Digi-Reel®; Part Status: Active; Voltage - Rated: 25V; Temperature Coefficient: X7R; Operating Temperature: -55°C ~ 125°C; Features: -; Ratings: -; Applications: General Purpose; Mounting Type: Surface Mount, MLCC; Package / Case: 0805 (2012 Metric); Size / Dimension: 0.079" L x 0.049" W (2.00mm x 1.25mm); Height - Seated (Max): -; Thickness (Max): 0.053" (1.35mm); Lead Spacing: -; Lead Style: -; ComponentLink1URL: http://www.murata.com/~/media/webrenewal/support/library/catalog/products/capacitor/mlcc/c02e.ashx; ComponentLink1Description: http://www.murata.com/~/media/webrenewal/support/library/catalog/products/capacitor/mlcc/c02e.ashx
C40 C42 C43 = CMP-1036-04795-1: as C22 on sheet FeedbackLoop; Supplier Part Number 1: 490-1673-6-ND; Temperature Coefficient: X7R; Thickness (Max): 0.053" (1.35mm); Supplier 2: Digi-Key; Supplier Part Number 2: 490-1683-6-ND; RoHS: RoHS Compliant; Category: Capacitors; Stock 2: 245331; Pricing 2: 1=0.14, 10=0.098, 100=0.0462, 500=0.0324, 1000=0.02683 (USD); Packaging: Digi-Reel®; Part Status: Active; Operating Temperature: -55°C ~ 125°C; Features: -; Ratings: -; Applications: General Purpose; Mounting Type: Surface Mount, MLCC; Package / Case: 0805 (2012 Metric); Size / Dimension: 0.079" L x 0.049" W (2.00mm x 1.25mm); Height - Seated (Max): -; Lead Spacing: -; Lead Style: -; ComponentLink1URL: http://www.murata.com/~/media/webrenewal/support/library/catalog/products/capacitor/mlcc/c02e.ashx; ComponentLink1Description: http://www.murata.com/~/media/webrenewal/support/library/catalog/products/capacitor/mlcc/c02e.ashx
C41 = CMP-1036-04795-1: Manufacturer: Kemet; Manufacturer Part Number: C0805X105K4RACTU; Dielectric Material: Ceramic; Tolerance: 10%; Dissipation Factor: 3.5%; Supplier 1: Digi-Key; Supplier Part Number 1: 399-5329-1-ND; Stock 1: 12821; Pricing 1: 1=0.72, 10=0.528, 100=0.3623, 500=0.2868, 1000=0.2415 (USD); Mount: Surface Mount; Case/Package: 0805; Case Code (Imperial): 0805; Case Code (Metric): 2012; Min Operating Temperature: -55°C; Max Operating Temperature: 125°C; Packaging: Tape and Reel; Voltage Rating (DC): 16V; Package Quantity: 1; Voltage Rating: 16V; Dielectric: X7R; Termination: SMD/SMT; Voltage: 16V; Length: 2.1mm; Height: 0.9mm; Width: 1.25mm; Thickness: 0.039inch; Depth: 1.25mm; Radiation Hardening: No; REACH SVHC: No SVHC; ComponentLink1URL: https://datasheet.ciiva.com/7842/1698763-7842475.pdf; ComponentLink1Description: https://datasheet.ciiva.com/7842/1698763-7842475.pdf; ComponentLink2URL: https://datasheet.ciiva.com/7842/1698763-7842476.pdf; ComponentLink2Description: https://datasheet.ciiva.com/7842/1698763-7842476.pdf; ComponentLink3URL: https://datasheet.ciiva.com/14593/70096394-14593295.pdf; ComponentLink3Description: https://datasheet.ciiva.com/14593/70096394-14593295.pdf
R32 = CMP-1013-00017-1: Manufacturer: Vishay Dale; Manufacturer Part Number: CRCW080510K0FKTA; Power (Watts): 0.125W, 1/8W; Temperature Coefficient: ±100ppm/°C; Supplier 1: Digi-Key; Supplier Part Number 1: 541-3016-6-ND; RoHS: RoHS non-compliant; Category: Resistors; Stock 1: 5348; Pricing 1: 1=0.14, 10=0.129, 100=0.0496, 1000=0.02183, 2500=0.01885 (USD); Packaging: Digi-Reel®; Part Status: Active; Tolerance: ±1%; Composition: Thick Film; Features: Automotive AEC-Q200; Operating Temperature: -55°C ~ 155°C; Package / Case: 0805 (2012 Metric); Supplier Device Package: 0805; Size / Dimension: 0.079" L x 0.049" W (2.00mm x 1.25mm); Height - Seated (Max): 0.020" (0.50mm); Failure Rate: -; ComponentLink1URL: http://www.vishay.com/docs/20008/dcrcw.pdf; ComponentLink1Description: http://www.vishay.com/docs/20008/dcrcw.pdf
R33 = CMP-1013-00017-1: as R16 on sheet FeedbackLoop; Supplier 1: Digi-Key; Supplier Part Number 1: 541-0.0ADKR-ND; RoHS: RoHS Compliant; Category: Resistors; Stock 1: 869775; Pricing 1: 1=0.1, 10=0.026, 25=0.0184, 50=0.014, 100=0.0104, 250=0.00792, 500=0.00634, 1000=0.00466 (USD); Packaging: Digi-Reel®; Part Status: Active; Tolerance: Jumper; Composition: Thick Film; Features: Automotive AEC-Q200; Temperature Coefficient: -; Operating Temperature: -55°C ~ 155°C; Package / Case: 0805 (2012 Metric); Supplier Device Package: 0805; Size / Dimension: 0.079" L x 0.049" W (2.00mm x 1.25mm); Height - Seated (Max): 0.020" (0.50mm); Failure Rate: -; ComponentLink1URL: http://www.vishay.com/docs/20035/dcrcwe3.pdf; ComponentLink1Description: http://www.vishay.com/docs/20035/dcrcwe3.pdf
R34 = CMP-1013-00017-1: Manufacturer: Vishay Dale; Manufacturer Part Number: CRCW08051K00FKTA; Power (Watts): 0.125W, 1/8W; Temperature Coefficient: ±100ppm/°C; Supplier 1: Digi-Key; Supplier Part Number 1: 541-1.00KAWDKR-ND; RoHS: RoHS non-compliant; Category: Resistors; Stock 1: 57884; Pricing 1: 1=0.14, 10=0.129, 100=0.0496, 1000=0.02183, 2500=0.01885 (USD); Packaging: Digi-Reel®; Part Status: Active; Tolerance: ±1%; Composition: Thick Film; Features: Automotive AEC-Q200; Operating Temperature: -55°C ~ 155°C; Package / Case: 0805 (2012 Metric); Supplier Device Package: 0805; Size / Dimension: 0.079" L x 0.049" W (2.00mm x 1.25mm); Height - Seated (Max): 0.020" (0.50mm); Failure Rate: -; ComponentLink1URL: http://www.vishay.com/docs/20008/dcrcw.pdf; ComponentLink1Description: http://www.vishay.com/docs/20008/dcrcw.pdf
U13 U14 = CMP-0809-00001-2: 0.03 uV/C, Low Noise, Rail-to-Rail Output, Zero-Drift Operational Amplifier, 4 to 36 V, -40 to 125 degC, 14-pin SOIC (D14), Green (RoHS & no Sb/Br); Manufacturer: Texas Instruments; Total Supply Voltage(Min)(+5V is 5, +/-5V is 10): 4; Offset Drift(Typ)(uV/C): 0.03; Rating: Catalog; Slew Rate(Typ)(V/us): 0.8; Iq per channel(Max)(mA): 0.475; GBW(Typ)(MHz): 2; Packing: LARGE T&R; SubFamily: High Supply Voltage Amplifier (>=30V), Low Noise Amp (<=10nV/rtHz), Low Offset Voltage Amplifier (<=500uV), Low Power Amp (<=500uA), Zero Drift Precision Amplifier; Total Supply Voltage(Max)(+5V is 5, +/-5V is 10): 36; CMRR(Min)(dB): 120; PackageDescription: 14-Pin Plastic Small Outline, Body 8.65 x 3.9 mm, Pitch 1.27 mm; Mounting Technology: Surface Mount; ComponentLink3URL: http://www.ti.com/lit/ml/mpds177g/mpds177g.pdf; ComponentLink1URL: http://www.ti.com/; ComponentLink1Description: Manufacturer URL; PartNumber: OPA4188AIDR; ComponentLink2Description: Datasheet; Number of Channels: 4; Code_JEDEC: MS-012; PackageReference: D0014A; ComponentLink2URL: http://www.ti.com/lit/ds/symlink/opa4188.pdf; DatasheetVersion: SBOS641B; ComponentLink3Description: Package Specification; Eco-Plan: Green (RoHS & no Sb/Br); PackageVersion: 4040047-5/M, 06/2011; PartId: 1
U15 = MAX1300AEUG: IC ADC 16BIT SRL 115KSPS 24TSSOP; Manufacturer 1: Maxim Integrated; Manufacturer Part Number 1: MAX1300AEUG+; Category 1: Integrated Circuits (ICs); Number of Bits: 16; Sampling Rate (Per Second): 115k; Number of Inputs: 4, 8; Input Type: Differential, Single Ended; Data Interface: SPI; Configuration: MUX-PGA-S/H-ADC; Ratio - S/H:ADC: 1:1; Number of A/D Converters: 1; Architecture: SAR; Reference Type: External, Internal; Voltage - Supply, Analog: 5V; Supplier 2: Mouser; Supplier Part Number 2: 700-MAX1300AEUG+; Supplier 1: Digi-Key; Supplier Part Number 1: MAX1300AEUG+-ND; RoHS 1: RoHS Compliant; Description 1: IC ADC 16BIT SRL 115KSPS 24TSSOP; Stock 1: 1553; Pricing 1: 1=13.94, 10=13.24, 50=13.16 (USD); Packaging: Tube; Part Status: Active; Voltage - Supply, Digital: 5V; Features: PGA; Operating Temperature: -40°C ~ 85°C; Package / Case: 24-TSSOP (0.173", 4.40mm Width); Supplier Device Package: 24-TSSOP; ComponentLink1URL: http://datasheets.maximintegrated.com/en/ds/MAX1300-MAX1301.pdf; ComponentLink1Description: http://datasheets.maximintegrated.com/en/ds/MAX1300-MAX1301.pdf